# Altium schematic sheet delta-bob-cat.SchDoc: smoothieboard breadboard connections
size A3; Organization: delta-bob-cat 3D Printer; DocumentNumber: ELE-2015-01-SCH; Revision: 0.1; SheetNumber: 1; SheetTotal: 1; Date: 2015-06-16; ApprovedBy: ###; Author: Adnan Jalaludin; CompanyName: Hackerspace.SG; PageSetup: Record=PageOptions|CenterHorizontal=True|CenterVertical=True|PrintScale=0.73|XCorrection=1.00|YCorrection=1.00|PrintKind=1|BorderSize=5000000|LeftOffset=10|BottomOffset=10|Orientation=2|PaperLength=1000|PaperWidth=1000|Scale=100|PaperSource=7|PrintQuality=600|MediaType=1|DitherType=10|PaperKind=A4|PrintScaleMode=0; DocumentName: Schematic; ModifiedDate: 2015-06-16; ProjectName: ProjectName
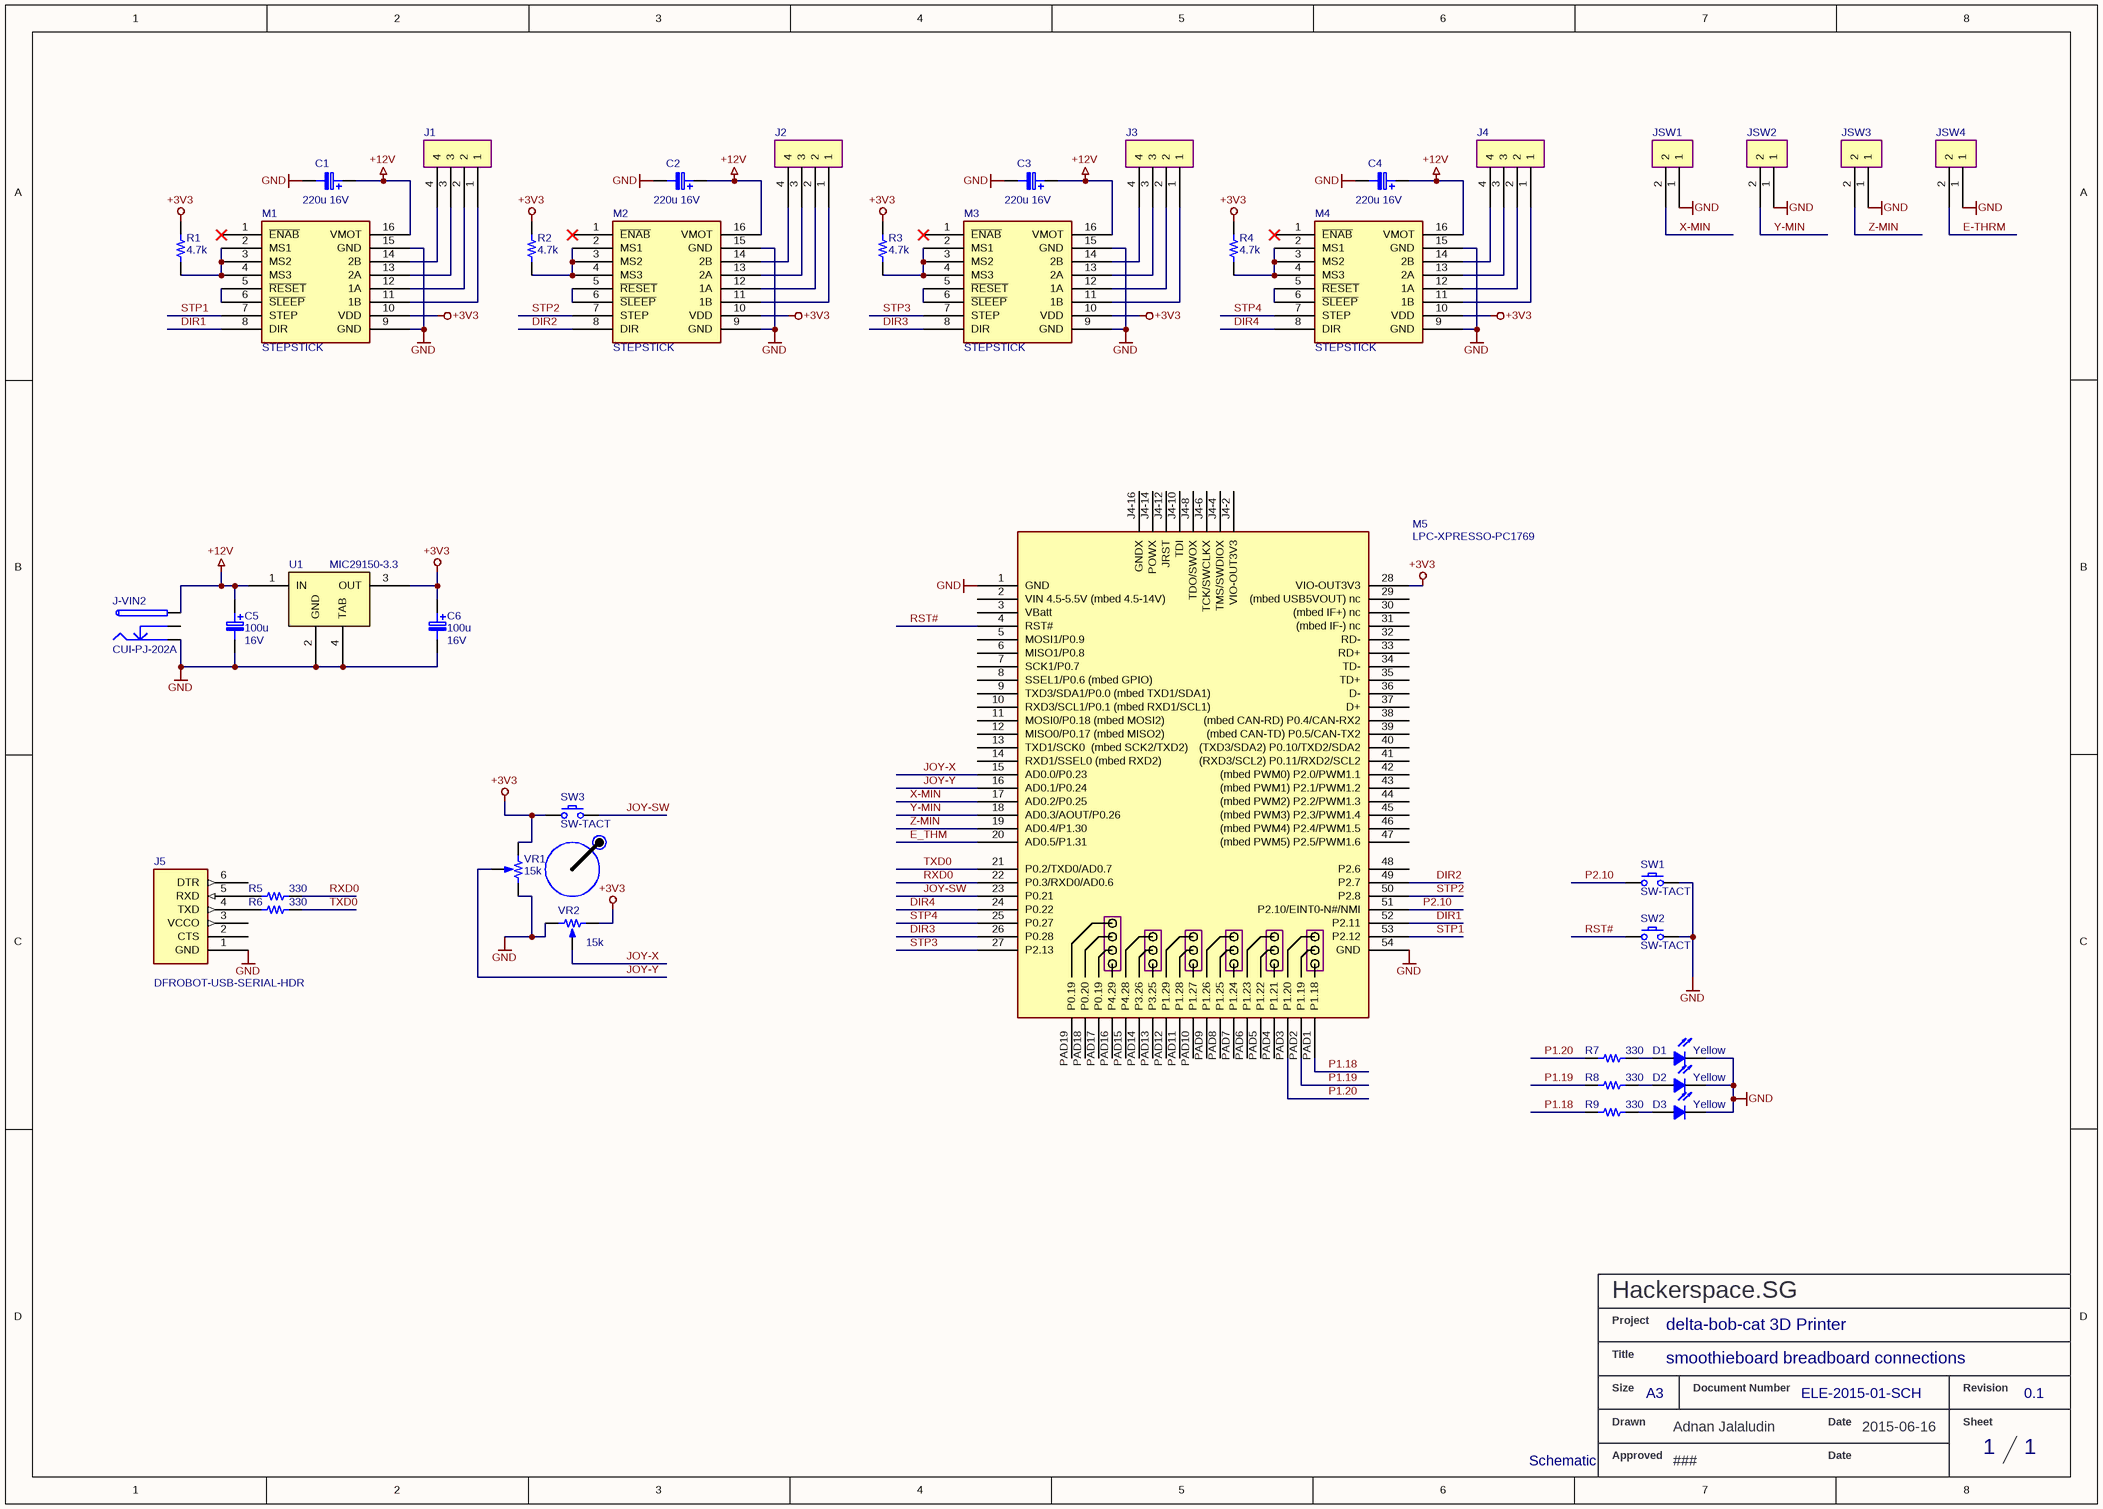
[diagram p0: delta-bob-cat.SchDoc]

## Parts
C1  220u  Rating: 16V  [ECAP-D]
C2  220u  Rating: 16V  [ECAP-D]
C3  220u  Rating: 16V  [ECAP-D]
C4  220u  Rating: 16V  [ECAP-D]
C5  100u  Rating: 16V  [ECAP-A]
C6  100u  Rating: 16V  [ECAP-A]
D1  Yellow  [RC0603P]
D2  Yellow  [RC0603P]
D3  Yellow  [RC0603P]
J1  HDR-4  [HDR4-P2.50-VSTRIP]  (value not drawn)
J2  HDR-4  [HDR4-P2.50-VSTRIP]  (value not drawn)
J3  HDR-4  [HDR4-P2.50-VSTRIP]  (value not drawn)
J4  HDR-4  [HDR4-P2.50-VSTRIP]  (value not drawn)
J5  DFROBOT-USB-SERIAL-HDR  [HDR6-P2.50-VSTRIP]
J-VIN2  CUI-PJ-202A  [POWER-CUI-PJ-202A]  (graphical)
JSW1  HDR-2  [HDR2-P2.50-VSTRIP]  (value not drawn)
JSW2  HDR-2  [HDR2-P2.50-VSTRIP]  (value not drawn)
JSW3  HDR-2  [HDR2-P2.50-VSTRIP]  (value not drawn)
JSW4  HDR-2  [HDR2-P2.50-VSTRIP]  (value not drawn)
M1  STEPSTICK  [MODULE-STEPSTICK]
M2  STEPSTICK  [MODULE-STEPSTICK]
M3  STEPSTICK  [MODULE-STEPSTICK]
M4  STEPSTICK  [MODULE-STEPSTICK]
M5  LPC-XPRESSO-PC1769  [MODULE-MBED-XPRESSO-EXTND]
R1  4.7k  [RC0603]
R2  4.7k  [RC0603]
R3  4.7k  [RC0603]
R4  4.7k  [RC0603]
R5  330  [RC0603]
R6  330  [RC0603]
R7  330  [RC0603]
R8  330  [RC0603]
R9  330  [RC0603]
SW1  SW-TACT  [SWTACT2-P6.50-W3.50]
SW2  SW-TACT  [SWTACT2-P6.50-W3.50]
SW3  SW-TACT  [SWTACT2-P6.50-W3.50]
U1  MIC29150-3.3  [TO263]
VR1  15k  [BI-TRIMMER68W]
VR2  15k  [BI-TRIMMER68W]

## Nets
+3V3: C6.1 M1.10(VDD) M2.10(VDD) M3.10(VDD) M4.10(VDD) M5.28(VIO-OUT3V3) R1.2(BOT) R2.2(BOT) R3.2(BOT) R4.2(BOT) SW3.1 U1.3(OUT) VR1.1(CCW) VR2.3(CW)
+12V: C1.1 C2.1 C3.1 C4.1 C5.1 J-VIN2.1 M1.16(VMOT) M2.16(VMOT) M3.16(VMOT) M4.16(VMOT) U1.1(IN)
GND: C1.2 C2.2 C3.2 C4.2 C5.2 C6.2 D1.1(K) D2.1(K) D3.1(K) J5.1(GND) J-VIN2.2 JSW1.1 JSW2.1 JSW3.1 JSW4.1 M1.9(GND) M1.15(GND) M2.9(GND) M2.15(GND) M3.9(GND) M3.15(GND) M4.9(GND) M4.15(GND) M5.1(GND) M5.54(GND) SW1.1 SW2.1 U1.2(GND) U1.4(TAB) VR1.3(CW) VR2.1(CCW)
DIR1: M1.8(DIR) M5.52(P2.11)
DIR2: M2.8(DIR) M5.49(P2.7)
DIR3: M3.8(DIR) M5.26(P0.28)
DIR4: M4.8(DIR) M5.24(P0.22)
E-THRM: JSW4.2
E_THM: M5.20(AD0.5/P1.31)
JOY-SW: M5.23(P0.21) SW3.2
JOY-X: M5.15(AD0.0/P0.23) VR2.2(TAP)
JOY-Y: M5.16(AD0.1/P0.24) VR1.2(TAP)
P1.18: M5.PAD1(P1.18) R9.1(TOP)
P1.19: M5.PAD2(P1.19) R8.1(TOP)
P1.20: M5.PAD3(P1.20) R7.1(TOP)
P2.10: M5.51(P2.10/EINT0-N#/NMI) SW1.2
RST#: M5.4(RST#) SW2.2
RXD0: M5.22(P0.3/RXD0/AD0.6) R5.2(BOT)
STP1: M1.7(STEP) M5.53(P2.12)
STP2: M2.7(STEP) M5.50(P2.8)
STP3: M3.7(STEP) M5.27(P2.13)
STP4: M4.7(STEP) M5.25(P0.27)
TXD0: M5.21(P0.2/TXD0/AD0.7) R6.2(BOT)
X-MIN: JSW1.2 M5.17(AD0.2/P0.25)
Y-MIN: JSW2.2 M5.18(AD0.3/AOUT/P0.26)
Z-MIN: JSW3.2 M5.19(AD0.4/P1.30)
NetD1_2: D1.2(A) R7.2(BOT)
NetD2_2: D2.2(A) R8.2(BOT)
NetD3_2: D3.2(A) R9.2(BOT)
NetJ1_1: J1.1 M1.11(1B)
NetJ1_2: J1.2 M1.12(1A)
NetJ1_3: J1.3 M1.13(2A)
NetJ1_4: J1.4 M1.14(2B)
NetJ2_1: J2.1 M2.11(1B)
NetJ2_2: J2.2 M2.12(1A)
NetJ2_3: J2.3 M2.13(2A)
NetJ2_4: J2.4 M2.14(2B)
NetJ3_1: J3.1 M3.11(1B)
NetJ3_2: J3.2 M3.12(1A)
NetJ3_3: J3.3 M3.13(2A)
NetJ3_4: J3.4 M3.14(2B)
NetJ4_1: J4.1 M4.11(1B)
NetJ4_2: J4.2 M4.12(1A)
NetJ4_3: J4.3 M4.13(2A)
NetJ4_4: J4.4 M4.14(2B)
NetJ5_4: J5.4(TXD) R6.1(TOP)
NetJ5_5: J5.5(RXD) R5.1(TOP)
NetM1_2: M1.2(MS1) M1.3(MS2) M1.4(MS3) R1.1(TOP)
NetM1_5: M1.5(~{RESET}) M1.6(~{SLEEP})
NetM2_2: M2.2(MS1) M2.3(MS2) M2.4(MS3) R2.1(TOP)
NetM2_5: M2.5(~{RESET}) M2.6(~{SLEEP})
NetM3_2: M3.2(MS1) M3.3(MS2) M3.4(MS3) R3.1(TOP)
NetM3_5: M3.5(~{RESET}) M3.6(~{SLEEP})
NetM4_2: M4.2(MS1) M4.3(MS2) M4.4(MS3) R4.1(TOP)
NetM4_5: M4.5(~{RESET}) M4.6(~{SLEEP})

Not connected (* = marked no-connect by the designer): J5 2(CTS) 3(VCCO) 6(DTR); J-VIN2 3; M1 1(~{ENAB})*; M2 1(~{ENAB})*; M3 1(~{ENAB})*; M4 1(~{ENAB})*; M5 2(VIN_4.5-5.5V_(mbed_4.5-14V)) 3(VBatt) 5(MOSI1/P0.9) 6(MISO1/P0.8) 7(SCK1/P0.7) 8(SSEL1/P0.6_(mbed_GPIO)) 9(TXD3/SDA1/P0.0_(mbed_TXD1/SDA1)) 10(RXD3/SCL1/P0.1_(mbed_RXD1/SCL1)) 11(MOSI0/P0.18_(mbed_MOSI2)) 12(MISO0/P0.17_(mbed_MISO2)) 13(TXD1/SCK0__(mbed_SCK2/TXD2)) 14(RXD1/SSEL0_(mbed_RXD2)) 29((mbed_USB5VOUT)_nc) 30((mbed_IF+)_nc) 31((mbed_IF-)_nc) 32(RD-) 33(RD+) 34(TD-) 35(TD+) 36(D-) 37(D+) 38((mbed_CAN-RD)_P0.4/CAN-RX2) 39((mbed_CAN-TD)_P0.5/CAN-TX2) 40((TXD3/SDA2)_P0.10/TXD2/SDA2) 41((RXD3/SCL2)_P0.11/RXD2/SCL2) 42((mbed_PWM0)_P2.0/PWM1.1) 43((mbed_PWM1)_P2.1/PWM1.2) 44((mbed_PWM2)_P2.2/PWM1.3) 45((mbed_PWM3)_P2.3/PWM1.4) 46((mbed_PWM4)_P2.4/PWM1.5) 47((mbed_PWM5)_P2.5/PWM1.6) 48(P2.6) J4-2(VIO-OUT3V3) J4-4(TMS/SWDIOX) J4-6(TCK/SWCLKX) J4-8(TDO/SWOX) J4-10(TDI) J4-12(JRST) J4-14(POWX) J4-16(GNDX) PAD4(P1.21) PAD5(P1.22) PAD6(P1.23) PAD7(P1.24) PAD8(P1.25) PAD9(P1.26) PAD10(P1.27) PAD11(P1.28) PAD12(P1.29) PAD13(P3.25) PAD14(P3.26) PAD15(P4.28) PAD16(P4.29) PAD17(P0.19) PAD18(P0.20) PAD19(P0.19)

## Notes on the sheet
- Project
- Title
- Size
- A3
- Document Number
- Revision
- Drawn
- Approved
- Date
- Sheet

## Library data of the parts
C1-C4 = CElect: Cap Elect SMT Dia 6.3mm; Tolerance: 20%; Material: Aluminium; AVL: Panasonic ECA-1EM101
C5 C6 = CElect: Cap Elect; Tolerance: 20%; Material: Aluminium
D1-D3 = LED_OLD: LED
J1-J4 = HDR-4: Header, 4-pin
J5 = DFROBOT-USB-SERIAL-HDR: Module, Bluetooth
J-VIN2 = POWER-SKT-LV: Jack Power 2.10/6.50mm; Vendor: CUI
JSW1-JSW4 = HDR-2: Header, 2-pin
M1-M4 = STEPSTICK: Module Stepstick
M5 = LPC-XPRESSO-PC1769: Module LPC-Xpresso-PC1769; Vendor: NXP
R1-R9 = R: Res Chip; Tolerance: 5%; Rating: 0.1W; Material: ThickFilm
SW1-SW3 = SW-TACT: Switch SPST-NO Tactile
U1 = MIC29150: IC Regulator LDO; Vendor: Micrel; Value: MIC29150-3.3
VR1 VR2 = POT: Res Trimmer; Vendor: Open